# Altium schematic sheet Audio_Amp.SchDoc
size A4; Organization: Altium Limited; Address1: L3, 12a Rodborough Rd; Address2: Frenchs Forest; Address3: NSW; Address4: Australia 2086
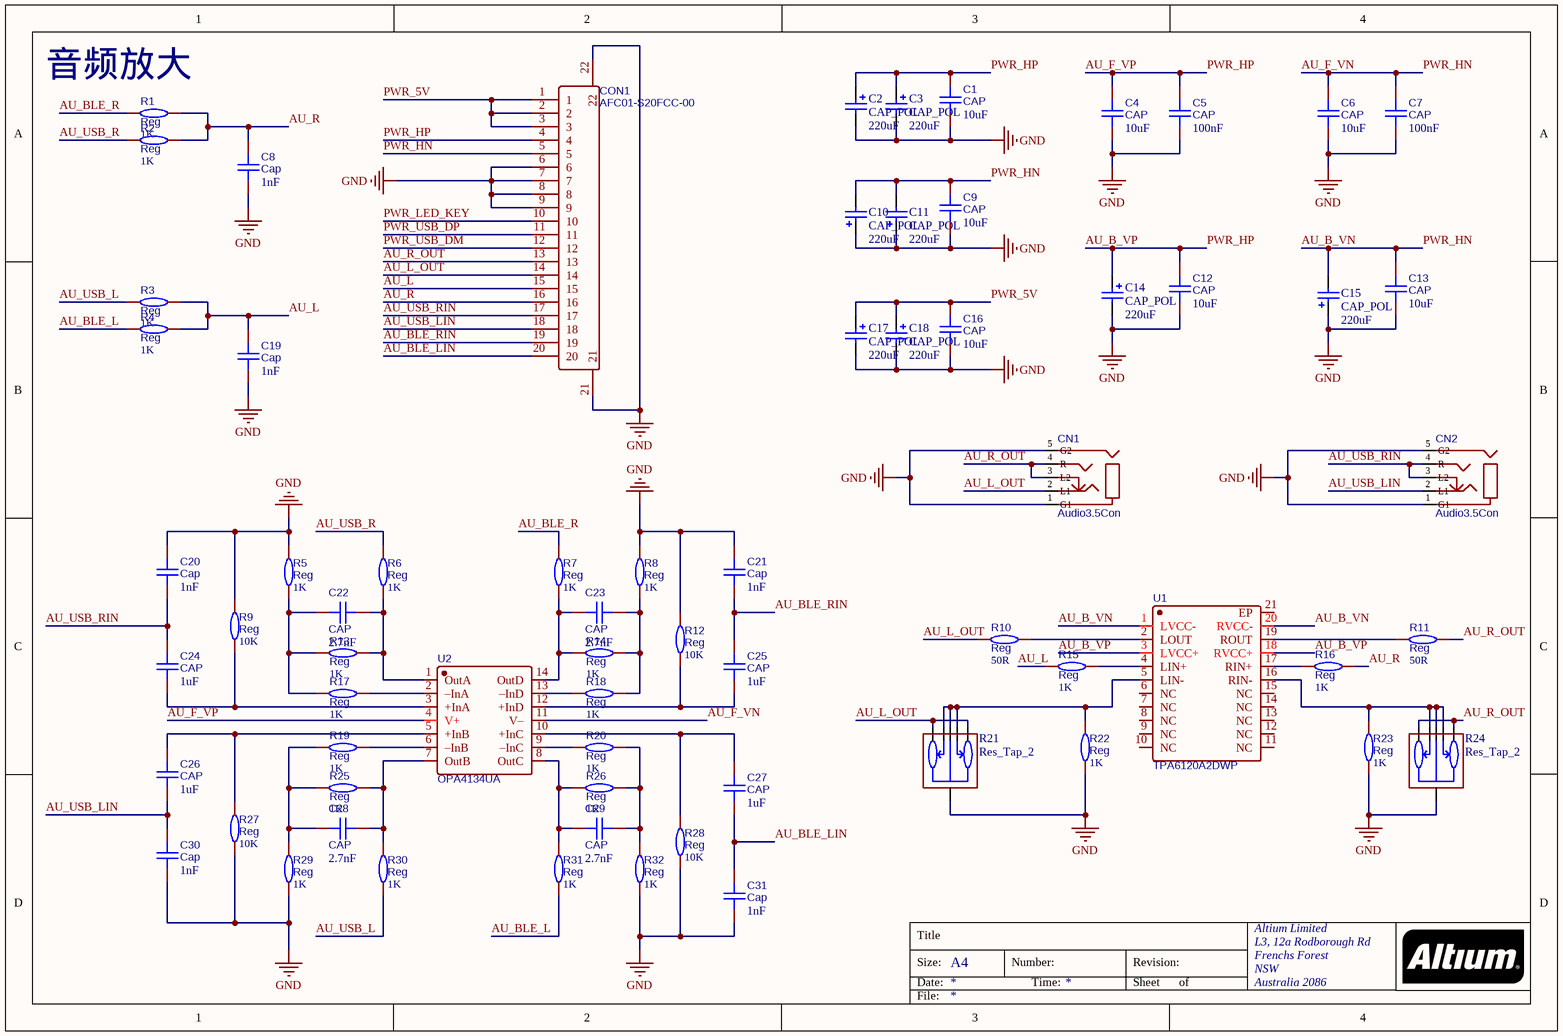
[diagram p0: Audio_Amp.SchDoc]

## Parts
C1  CAP  value 10uF  [C0603]
C2  CAP_POL  value 220uF  [CAP_SMD_6.3mm]
C3  CAP_POL  value 220uF  [CAP_SMD_6.3mm]
C4  CAP  value 10uF  [C0603]
C5  CAP  value 100nF  [C0603]
C6  CAP  value 10uF  [C0603]
C7  CAP  value 100nF  [C0603]
C8  Cap  value 1nF  [C0603]
C9  CAP  value 10uF  [C0603]
C10  CAP_POL  value 220uF  [CAP_SMD_6.3mm]
C11  CAP_POL  value 220uF  [CAP_SMD_6.3mm]
C12  CAP  value 10uF  [C0603]
C13  CAP  value 10uF  [C0603]
C14  CAP_POL  value 220uF  [CAP_SMD_6.3mm]
C15  CAP_POL  value 220uF  [CAP_SMD_6.3mm]
C16  CAP  value 10uF  [C0603]
C17  CAP_POL  value 220uF  [CAP_SMD_6.3mm]
C18  CAP_POL  value 220uF  [CAP_SMD_6.3mm]
C19  Cap  value 1nF  [C0603]
C20  Cap  value 1nF  [C0603]
C21  Cap  value 1nF  [C0603]
C22  CAP  value 2.7nF  [C0603]
C23  CAP  value 2.7nF  [C0603]
C24  CAP  value 1uF  [C0603]
C25  CAP  value 1uF  [C0603]
C26  CAP  value 1uF  [C0603]
C27  CAP  value 1uF  [C0603]
C28  CAP  value 2.7nF  [C0603]
C29  CAP  value 2.7nF  [C0603]
C30  Cap  value 1nF  [C0603]
C31  Cap  value 1nF  [C0603]
CN1  Audio3.5Con  [Audio3.5_3Pin]
CN2  Audio3.5Con  [Audio3.5_3Pin]
CON1  AFC01-S20FCC-00  [FPC-SMD_20P_0.5]
R1  Reg  value 1K  [R0603]
R2  Reg  value 1K  [R0603]
R3  Reg  value 1K  [R0603]
R4  Reg  value 1K  [R0603]
R5  Reg  value 1K  [R0603]
R6  Reg  value 1K  [R0603]
R7  Reg  value 1K  [R0603]
R8  Reg  value 1K  [R0603]
R9  Reg  value 10K  [R0603]
R10  Reg  value 50R  [R0603]
R11  Reg  value 50R  [R0603]
R12  Reg  value 10K  [R0603]
R13  Reg  value 1K  [R0603]
R14  Reg  value 1K  [R0603]
R15  Reg  value 1K  [R0603]
R16  Reg  value 1K  [R0603]
R17  Reg  value 1K  [R0603]
R18  Reg  value 1K  [R0603]
R19  Reg  value 1K  [R0603]
R20  Reg  value 1K  [R0603]
R21  Res_Tap_2  [RES_TAP_5Pin]
R22  Reg  value 1K  [R0603]
R23  Reg  value 1K  [R0603]
R24  Res_Tap_2  [RES_TAP_5Pin]
R25  Reg  value 1K  [R0603]
R26  Reg  value 1K  [R0603]
R27  Reg  value 10K  [R0603]
R28  Reg  value 10K  [R0603]
R29  Reg  value 1K  [R0603]
R30  Reg  value 1K  [R0603]
R31  Reg  value 1K  [R0603]
R32  Reg  value 1K  [R0603]
U1  TPA6120A2DWP  [HSOP-20]
U2  OPA4134UA  [SOIC-14]

## Nets
GND: C1.1 C2.2 C3.2 C4.1 C5.1 C6.1 C7.1 C8.1 C9.1 C10.1 C11.1 C12.1 C13.1 C14.2 C15.1 C16.1 C17.2 C18.2 C19.1 C20.2 C21.2 C30.2 C31.1 CN1.1(G1) CN1.5(G2) CN2.1(G1) CN2.5(G2) CON1.6 CON1.7 CON1.8 CON1.9 CON1.21 CON1.22 R5.2 R8.2 R9.1 R12.1 R21.6(PAD) R22.1 R23.1 R24.6(PAD) R27.2 R28.2 R29.1 R32.1
AU_B_VN: C6.2 C7.2 C9.2 C10.2 C11.2 C13.2 C15.2 CON1.5 U1.1(LVCC-) U1.20(RVCC-) U2.11(V–)  [also labelled AU_F_VN, PWR_HN]
AU_B_VP: C1.2 C2.1 C3.1 C4.2 C5.2 C12.2 C14.1 CON1.4 U1.3(LVCC+) U1.18(RVCC+) U2.4(V+)  [also labelled AU_F_VP, PWR_HP]
AU_BLE_L: R4.2 R31.1
AU_BLE_LIN: C27.1 C31.2 CON1.20
AU_BLE_R: R1.2 R7.2
AU_BLE_RIN: C21.1 C25.2 CON1.19
AU_L: C19.2 CON1.15 R3.1 R4.1 R15.1
AU_L_OUT: CN1.2(L1) CON1.14 R10.1 R21.4(CH2B) R21.5(CH1B)
AU_R: C8.2 CON1.16 R1.1 R2.1 R16.2
AU_R_OUT: CN1.3(L2) CN1.4(R) CON1.13 R11.2 R24.4(CH2B) R24.5(CH1B)
AU_USB_L: R3.2 R30.1
AU_USB_LIN: C26.2 C30.1 CN2.2(L1) CON1.18
AU_USB_R: R2.2 R6.2
AU_USB_RIN: C20.1 C24.1 CN2.3(L2) CN2.4(R) CON1.17
PWR_5V: C16.2 C17.1 C18.1 CON1.1 CON1.2 CON1.3
PWR_LED_KEY: CON1.10
PWR_USB_DM: CON1.12
PWR_USB_DP: CON1.11
NetC22_1: C22.1 R5.1 R13.2 R17.2
NetC22_2: C22.2 R6.1 R13.1 U2.1(OutA)
NetC23_1: C23.1 R7.1 R14.2 U2.14(OutD)
NetC23_2: C23.2 R8.1 R14.1 R18.1
NetC24_2: C24.2 R9.2 U2.3(+InA)
NetC25_1: C25.1 R12.2 U2.12(+InD)
NetC26_1: C26.1 R27.1 U2.5(+InB)
NetC27_2: C27.2 R28.1 U2.10(+InC)
NetC28_1: C28.1 R19.2 R25.2 R29.2
NetC28_2: C28.2 R25.1 R30.2 U2.7(OutB)
NetC29_1: C29.1 R26.2 R31.2 U2.8(OutC)
NetC29_2: C29.2 R20.1 R26.1 R32.2
NetR10_2: R10.2 U1.2(LOUT)
NetR11_1: R11.1 U1.19(ROUT)
NetR15_2: R15.2 U1.4(LIN+)
NetR16_1: R16.1 U1.17(RIN+)
NetR17_1: R17.1 U2.2(–InA)
NetR18_2: R18.2 U2.13(–InD)
NetR19_1: R19.1 U2.6(–InB)
NetR20_2: R20.2 U2.9(–InC)
NetR21_1: R21.1(G) R21.2(CH1A) R21.3(CH2A) R22.2 U1.5(LIN-)
NetR23_2: R23.2 R24.1(G) R24.2(CH1A) R24.3(CH2A) U1.16(RIN-)

Not connected (* = marked no-connect by the designer): U1 6(NC) 7(NC) 8(NC) 9(NC) 10(NC) 11(NC) 12(NC) 13(NC) 14(NC) 15(NC) 21(EP)

## Notes on the sheet
- (near R1) 音频放大
- Title
- Size:
- Date:
- A4
- Number:
- Time:
- Revision:
- Sheet
- of
- File:

## Library data of the parts
C1 C4-C9 C12 C13 C16 C19-C31 = CAP: BOM_Manufacturer: Huaxin S&T; BOM_Manufacturer Part: 0603B103K101CT; nameAlias: Capacitance; Contributor: LCSC; BOM_Supplier: LCSC; BOM_Supplier Part: C302008; spicePre: C; spiceSymbolName: 0603B103K101CT
C2 C3 C10 C11 C14 C15 C17 C18 = CAP_POL: 极性电容
CN1 CN2 = AudioCon3: 3.5mm 3Pin 音频接口; BOM_Manufacturer: G-Switch(品赞); BOM_Manufacturer Part: PJ-393; Contributor: LCSC; BOM_Supplier: LCSC; BOM_Supplier Part: C2837065; BOM_JLCPCB Part Class: Extended Part; spicePre: C; spiceSymbolName: PJ-393_C2837065
CON1 = FPC_CONN_20: FPC连接器20Pin; BOM_Manufacturer: JUSHUO; Contributor: LCSC; BOM_Supplier: LCSC; BOM_Supplier Part: C262274; BOM_Manufacturer Part: AFC01-S20FCC-00; BOM_JLCPCB Part Class: Extended Part; spicePre: F; spiceSymbolName: AFC01-S20FCC-00
R1-R20 R22 R23 R25-R32 = Res: 电阻; BOM_Manufacturer: Viking Tech; BOM_Manufacturer Part: AR03BTCX1002A; nameAlias: Resistance (Ohms); Contributor: LCSC; BOM_Supplier: LCSC; BOM_Supplier Part: C465721; spicePre: R; spiceSymbolName: AR03BTCX1002A
R21 R24 = Res_Tap_2: 双联电位器
U1 = TPA6120: 耳放; BOM_Manufacturer: TI(德州仪器); Contributor: LCSC; BOM_Supplier: LCSC; BOM_Supplier Part: C2871054; BOM_Manufacturer Part: TPA6120A2DWP; link: https://atta.szlcsc.comnull; spicePre: U; spiceSymbolName: TPA6120A2DWP
U2 = OPA4134UA: 耳放; BOM_Manufacturer: TI(德州仪器); Contributor: LCSC; BOM_Supplier: LCSC; BOM_Supplier Part: C2832240; BOM_Manufacturer Part: OPA4134UA; BOM_JLCPCB Part Class: Extended Part; spicePre: U; spiceSymbolName: OPA4134UA